# EAGLE schematic schematic (EAGLE 7.6.0)
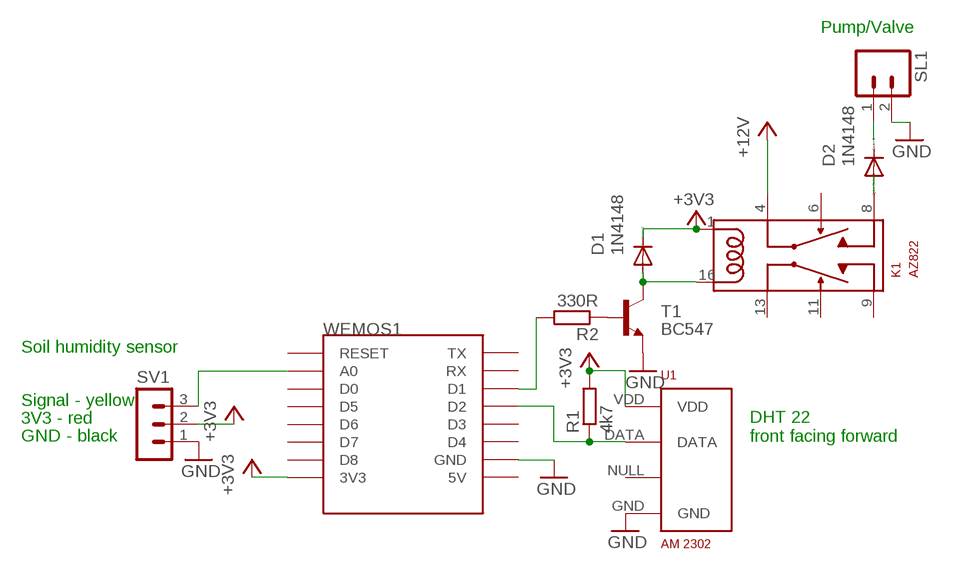
[diagram p0: schematic, sheet 1]

## Parts
D1  1N4148  1N4148DO35-10  [DO35-10]
D2  1N4148  1N4148DO35-10  [DO35-10]
K1  AZ822  [351]
R1  4k7  R-EU_0207/10  [0207/10]
R2  330R  R-EU_0207/10  [0207/10]
SL1  M02  [02P]
SV1  MA03-1  [MA03-1]
T1  BC547  [TO92]
U1  AM 2302  RHT03_DHT-22_AM2302  [RHT03_DHT-22]
WEMOS1  WEMOS-D1-MINI  [WEMOS-D1-MINI]

## Nets
+3V3: D1.C K1.1 K1.4 R1.2 SV1.2 U1.VDD WEMOS1.3V3 ; supply symbol labelled +12V
GND: SL1.2 SV1.1 T1.1(E) U1.GND WEMOS1.GND
N$1: R1.1 U1.DATA WEMOS1.D2
N$2: D1.A K1.16 T1.3(C)
N$3: SV1.3 WEMOS1.A0
N$4: K1.8
N$5: R2.2 WEMOS1.D1
N$6: R2.1 T1.2(B)
N$7: SL1.1
Unconnected: D2.A D2.C K1.6 K1.9 K1.11 K1.13 U1.NULL WEMOS1.5V WEMOS1.D0 WEMOS1.D3 WEMOS1.D4 WEMOS1.D5 WEMOS1.D6 WEMOS1.D7 WEMOS1.D8 WEMOS1.RESET WEMOS1.RX WEMOS1.TX

## Notes on the sheet
- Pump/Valve
- Soil humidity sensor
- Signal - yellow
- 3V3 - red
- GND - black
- DHT 22
  front facing forward

## Library data of the parts
D1 D2 = diode:1N4148: DIODE high speed (Philips)
K1 = az822:AZ822
R1 R2 = rcl:R-EU_: RESISTOR, European symbol; SPICEPREFIX: R
SL1 = con-amp-quick:M02: AMP QUICK CONNECTOR; OC_FARNELL: unknown; OC_NEWARK: unknown
SV1 = con-lstb:MA03-1: PIN HEADER; OC_FARNELL: unknown; OC_NEWARK: unknown
T1 = transistor:BC547: NPN TRANSISTOR
U1 = dht22:RHT03_DHT-22_AM2302: RHT03 / DHT-22 / AM2302 Packages and symbol for the RHT03 / DHT-22 relative humidity and temperature sensor. Note: The AM2302 is a wired version of the DHT-22 which typically requires less clearance and is thus provided as a separate package.; PROD_ID: SEN-10167
WEMOS1 = esp8266modules:WEMOS-D1-MINI: WeMos.cc D1 mini ESP8266 module